# EAGLE design AVR-PROG (EAGLE 5.07)
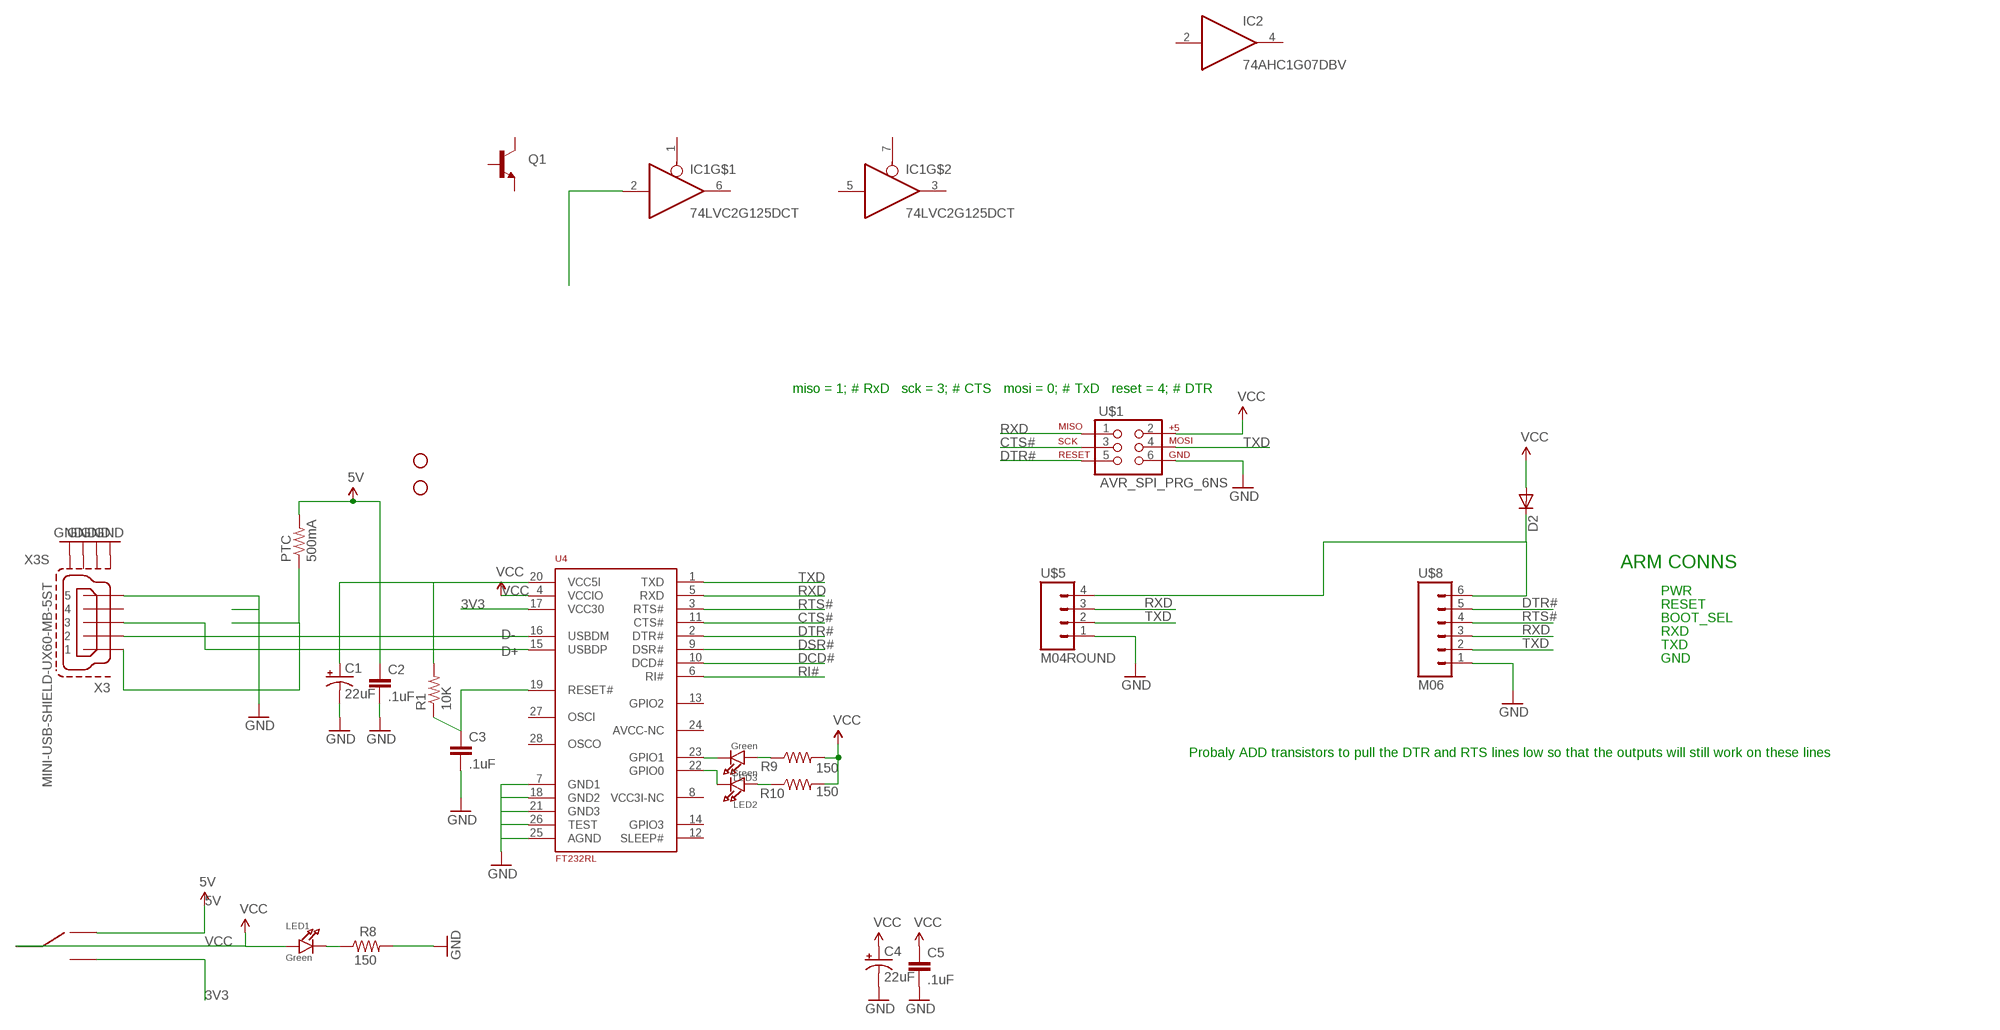
[diagram p0: schematic, sheet 1]

## Parts
C1  22uF  CAP_POL1206  [EIA3216]
C2  .1uF  CAP0805  [0805]
C3  .1uF  CAP0805  [0805]
C4  22uF  CAP_POL1206  [EIA3216]
C5  .1uF  CAP0805  [0805]
D2  DIODESOD  [SOD-323]
IC1  74LVC2G125DCT  [SSOP08]
IC2  74AHC1G07DBV  [SOT23-5]
LED1  Green  LED0805  [CHIPLED_0805]
LED2  Green  LED0805  [CHIPLED_0805]
LED3  Green  LED0805  [CHIPLED_0805]
PTC  500mA  RESISTOR  [0805]
Q1  TRANSISTOR_NPNSOT23-3  [SOT23-3]
R1  10K  RESISTOR  [0805]
R8  150  RESISTOR  [0805]
R9  150  RESISTOR  [0805]
R10  150  RESISTOR  [0805]
U4  FT232RL  [SSOP28]
U$1  AVR_SPI_PRG_6NS  [2X3-NS]
U$2  STAND-OFF  [STAND-OFF]
U$3  STAND-OFF  [STAND-OFF]
U$5  M04ROUND  [A19431-ROUND]
U$7  SWITCHSPDT  [OS102011MS2QS1]
U$8  M06  [A19433-ROUND]
X3  MINI-USB-SHIELD-UX60-MB-5ST  [UX60-MB-5ST]

## Nets
3V3: U4.17(VCC30) U$7.A
5V: C1.A(+) C2.1 PTC.2 R1.2 U4.20(VCC5I) U$7.B
CTS#: U4.11(CTS#) U$1.3
D+: U4.15(USBDP) X3.3
D-: U4.16(USBDM) X3.2
DCD#: U4.10(DCD#)
DSR#: U4.9(DSR#)
DTR#: U4.2(DTR#) U$1.5 U$8.5
GND [gnd]: C1.C(-) C2.2 C3.2 C4.C(-) C5.2 R8.2 U4.7(GND1) U4.18(GND2) U4.21(GND3) U4.25(AGND) U4.26(TEST) U$1.6 U$5.1 U$8.1 X3.5 X3.M1(S1) X3.M2(S2) X3.M3(S3) X3.M4(S4)
N$1: LED1.C R8.1
N$2: D2.1(C) U$5.4 U$8.6
N$3: IC1.2(I)
N$4: LED3.C U4.23(GPIO1)
N$5: PTC.1 X3.1
N$6: LED2.C U4.22(GPIO0)
N$35: LED3.A R9.1
N$36: LED2.A R10.1
RI#: U4.6(RI#)
RST: C3.1 R1.1 U4.19(RESET#)
RTS#: U4.3(RTS#) U$8.4
RXD: U4.5(RXD) U$1.1 U$5.3 U$8.3
TXD: U4.1(TXD) U$1.4 U$5.2 U$8.2
VCC: C4.A(+) C5.1 D2.2(A) LED1.A R9.2 R10.2 U4.4(VCCIO) U$1.2 U$7.COMMON
Unconnected: IC1.1(OE) IC1.3(O) IC1.5(I) IC1.6(O) IC1.7(OE) IC2.2(I) IC2.4(O) Q1.1(B) Q1.2(E) Q1.3(C) U4.8(VCC3I-NC) U4.12(SLEEP#) U4.13(GPIO2) U4.14(GPIO3) U4.24(AVCC-NC) U4.27(OSCI) U4.28(OSCO) X3.4

## Notes on the sheet
- miso = 1; # RxD   sck = 3; # CTS   mosi = 0; # TxD   reset = 4; # DTR
- ARM CONNS
- PWR
- RESET
- BOOT_SEL
- RXD
- TXD
- GND
- Probaly ADD transistors to pull the DTR and RTS lines low so that the outputs will still work on these lines

## Power pins joined to a net without a drawn wire
GND: IC1.4(GND) IC2.3(GND)
VCC: IC1.8(VCC) IC2.5(VCC)

## Library data of the parts
C1 C4 = SparkFun:CAP_POL: Capacitor Polarized These are standard SMD and PTH capacitors. Normally 10uF, 47uF, and 100uF in electrolytic and tantalum varieties. Always verify the external diameter of the through hole cap, it varies with capacity, voltage, and manufacturer. The EIA devices should be standard.
C2 C3 C5 = SparkFun:CAP: Capacitor Standard 0603 ceramic capacitor, and 0.1" leaded capacitor.
D2 = SparkFun:DIODE: Diode These are standard reverse protection diodes and small signal diodes. SMA package can handle up to about 1A. SOD-323 can handle about 200mA. What the SOD-323 package when ordering, there are some mfgs out there that are 5-pin packages.
IC1 = 74xx-little-us:74*2G125: Dual line drivers with 3-state outputs.
IC2 = 74xx-little-us:74*1G07: Single Buffer/Driver With Open-Drain Output
LED1-LED3 = microbuilder:LED: LED 0603 - 0603 Surface Mount Package Green LED - Low Power (3.9mcd, 2ma, 1.7Vf) Orange LED - Low Power (9.8mcd, 2ma, 1.8Vf) Red LED - Low Power (5mcd, 2ma, 1.8Vf) Yellow LED - Low Power (7mcd, 2ma, 1.8Vf) 0805 - 0805 Surface Mount Package Red LED (104mcd, 20mA, Diffused) - LS R976 [Digikey: 475-1278-6-ND] Red LED (12mcd, 20mA, 2.0Vf, Clear) - APT2012EC [Digikey: 754-1128-1-ND] Green LED (15mcd, 20mA, 2.2Vf, Clear) - APT2012GC [Digikey: 754-1131-1-ND] White LED (160mcd, 20mA, 2.1Vf, Clear) - APT2012SECK [Digikey: 754-1130-1-ND] 1206 - 1206 Surface Mount Package Green LED (26mcd, 20mA, Diffused) - LG N971 [Digikey: 475-1407-6-ND] Red LED (15mcd, 20mA, Diffused) - LH N974 [Digikey: 475-1416-6-ND]
PTC R1 R8-R10 = SparkFun:RESISTOR: Resistor Basic schematic elements and footprints for 0603, 1206, and PTH 1/10th watt (small) resistors.
Q1 = SparkFun:TRANSISTOR_NPN: Transistor NPN BJT configuration in SOT23 package. MMBT2222 is the common NPN we use. Double check BCE configuration again layout.
U4 = SmartPrj:FT232RL
U$1 = SparkFun:AVR_SPI_PRG_6: AVR ISP 6 Pin This is the reduced ISP connector for AVR programming. Common on Arduino. This footprint will take up less PCB space and can be used with a 10-pin to 6-pin adapter such as SKU: BOB-08508
U$2 U$3 = SparkFun:STAND-OFF: Stand Off This is the mechanical footprint for a #4 phillips button head screw. Use the keepout ring to avoid running the screw head into surrounding components. SKU : PRT-00447
U$5 = _Part Repository:M04: 4-Pin Headers
U$7 = JoesCustom:SWITCHSPDT
U$8 = _Part Repository:M06
X3 = con-hirose:MINI-USB-SHIELD-: MINI USB Connector Source: http://www.hirose.co.jp/cataloge_hp/e24000019.pdf

## Net classes
2 gnd: width 0.305 mm, drill 0.711 mm, clearance 0.254 mm
3 usbvcc: width 0.508 mm, drill 0.711 mm, clearance 0.254 mm

## Board
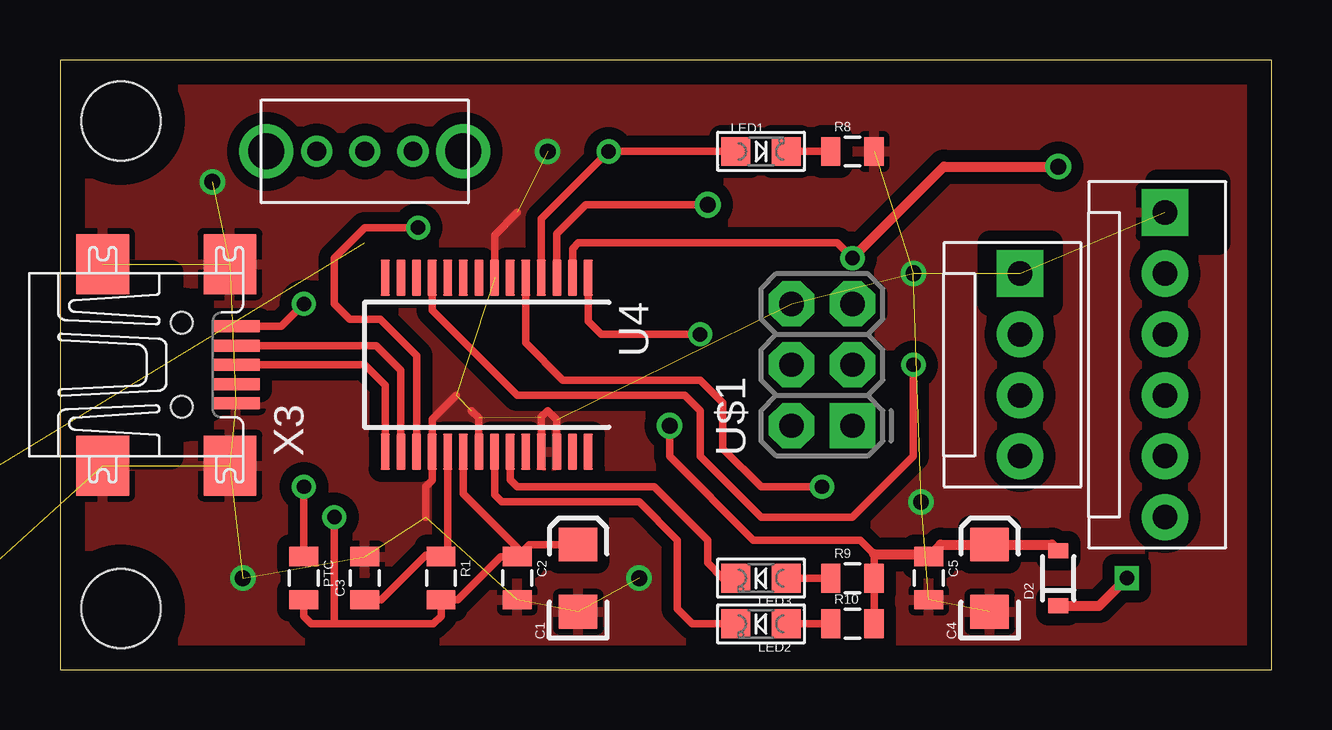
[diagram p1: board, top side]
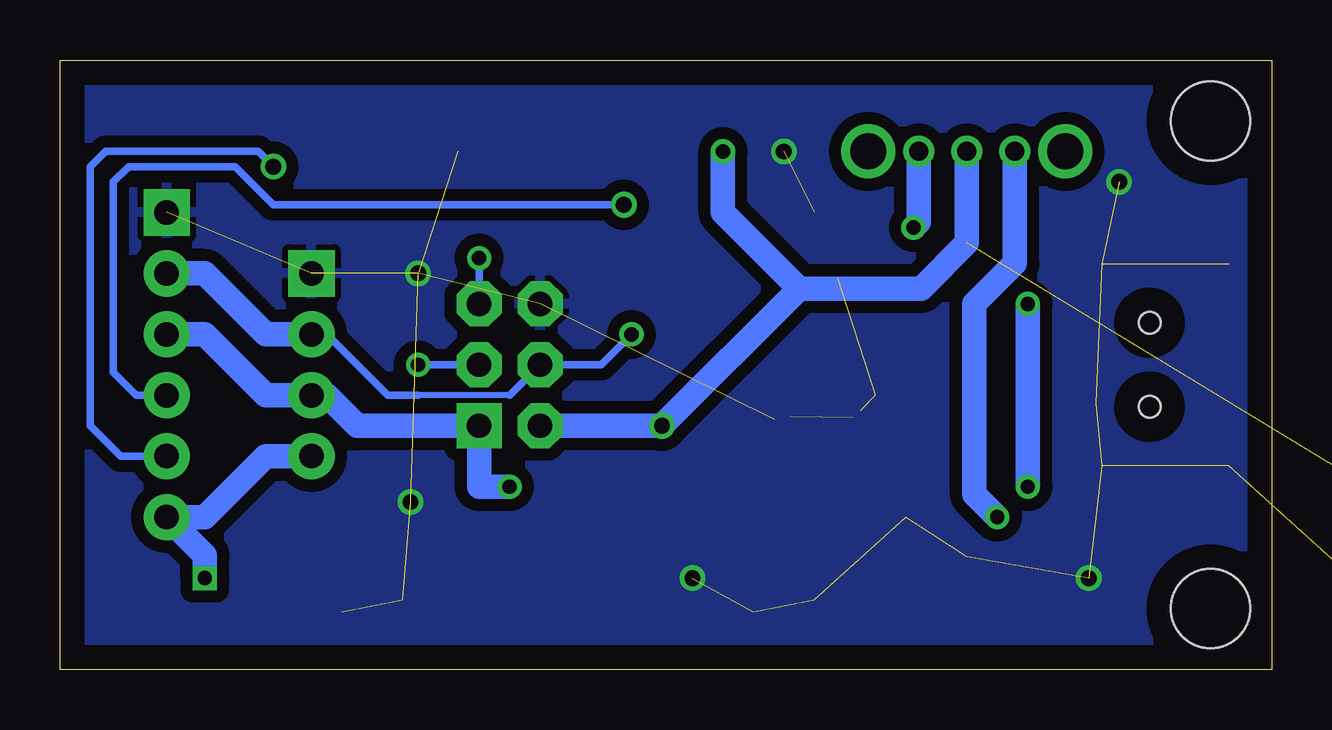
[diagram p2: board, bottom side, seen from below]

Size 50.48 x 25.4 mm. Coordinates in mm from the lower left corner, seen from the top.
Outline: 0,0 50.48,0 50.48,25.4 0,25.4 0,0
Copper layers (1*16): Top 0.035mm / dielectric 1.5mm / Bottom 0.035mm
Design rules "default": minimum track width 10mil, minimum drill 24mil, track to track 8mil, track to pad 8mil, pad to pad 8mil, via to via 8mil, smd to smd 8mil, copper to edge 40mil, drill to drill 8mil, minimum pad ring 10mil, minimum via ring 8mil, stop-mask expansion 4mil, vias tented up to drill 0mil, thermal gap 10mil
tRestrict: area 29.2,14 to 31.8,16.5; area 38.7,15.2 to 41.3,17.8; area 45.7,17.8 to 48.3,20.3

### Footprints (pad centres in the part's own frame; a part is rotated, then mirrored left to right if it is on the bottom)
EIA3216 = smd 1.4 x 1.6: A 1.4,0; C -1.4,0
0805 = smd 0.8 x 1.2: 1 -0.9,0; 2 0.9,0
SOD-323 = smd 0.63 x 0.83: 1 -1.15,0; 2 1.15,0
SSOP08 = smd 0.4 x 1: 1 -0.975,-1.8; 2 -0.325,-1.8; 3 0.325,-1.8; 4 0.975,-1.8; 5 0.975,1.8; 6 0.325,1.8; 7 -0.325,1.8; 8 -0.975,1.8
SOT23-5 = smd 0.69 x 0.99: 1 -0.95,-1.29; 2 0,-1.29; 3 0.95,-1.29; 4 0.95,1.3; 5 -0.95,1.3
CHIPLED_0805 = smd 1.2 x 1.2: A 0,-1.05; C 0,1.05
SOT23-3 = smd 0.8 x 0.9: 1 -0.95,-1; 2 0.95,-1; 3 0,1.1
SSOP28 = smd 0.381 x 1.499: 1 -4.225,-3.625; 2 -3.575,-3.625; 3 -2.925,-3.625; 4 -2.275,-3.625; 5 -1.625,-3.625; 6 -0.975,-3.625; 7 -0.325,-3.625; 8 0.325,-3.625; 9 0.975,-3.625; 10 1.625,-3.625; 11 2.275,-3.625; 12 2.925,-3.625; 13 3.575,-3.625; 14 4.225,-3.625; 15 4.225,3.625; 16 3.575,3.625; 17 2.925,3.625; 18 2.275,3.625; 19 1.625,3.625; 20 0.975,3.625; 21 0.325,3.625; 22 -0.325,3.625; 23 -0.975,3.625; 24 -1.625,3.625; 25 -2.275,3.625; 26 -2.925,3.625; 27 -3.575,3.625; 28 -4.225,3.625
2X3-NS = drill 1.016 pad 1.88 square: 1 -2.54,-1.27 | drill 1.016 pad 1.88 octagon: 2 -2.54,1.27; 3 0,-1.27; 4 0,1.27; 5 2.54,-1.27; 6 2.54,1.27
STAND-OFF = hole 3.302: 0,0
A19431-ROUND = drill 1.02 pad 1.93 square: 1 3.81,0 | drill 1.02 pad 1.93 round: 2 1.27,0; 3 -1.27,0; 4 -3.81,0
OS102011MS2QS1 = drill 0.787 round: A -2.007,0; B 2.007,0; COMMON 0,0 | drill 1.499 pad 1.905 round: CASE -4.102,0; CASE@1 4.102,0
A19433-ROUND = drill 1.02 pad 1.93 square: 1 6.35,0 | drill 1.02 pad 1.93 round: 2 3.81,0; 3 1.27,0; 4 -1.27,0; 5 -3.81,0; 6 -6.35,0
UX60-MB-5ST = smd 2 x 0.5: 1 2.25,1.6; 2 2.25,0.8; 3 2.25,0; 4 2.25,-0.8; 5 2.25,-1.6 | smd 2.2 x 2.5: M1 -3.3,-4.2; M2 -3.3,4.2; M3 2,4.2; M4 2,-4.2 | hole 0.9: 0,-1.75; 0,1.75

### Placement (x,y rotation side)
C1  21.59,3.81 90 top
C2  19.05,3.81 270 top
C3  12.7,3.81 90 top
C4  38.73,3.81 90 top
C5  36.2,3.81 270 top
D2  41.59,3.81 90 top
IC1  -6.35,3.81 0 top  (outside the outline)
IC2  -16.51,3.81 0 top  (outside the outline)
LED1  29.21,21.59 270 top
LED2  29.21,1.91 90 top
LED3  29.21,3.81 90 top
PTC  10.16,3.81 270 top
Q1  -21.59,-6.35 0 top  (outside the outline)
R1  15.88,3.81 270 top
R8  33.02,21.59 0 top
R9  33.02,3.81 0 top
R10  33.02,1.91 0 top
U4  17.78,12.7 180 top
U$1  31.75,12.7 90 top
U$2  2.54,22.86 0 top
U$3  2.54,2.54 0 top
U$5  40.01,12.7 90 top
U$7  12.7,21.59 180 top
U$8  46.04,12.7 90 top
X3  5.08,12.7 0 top

### Tracks (layer width: path | path; a pad name or v marks a point on that pad's centre or on a via)
3V3  (via drill 0.6)
  Top 0.305: U4.17 14.86,13.09 13.34,14.61 12.06,14.61 11.43,15.24 11.43,17.14 12.7,18.41 v14.92,18.41
  Bottom 1.016: U$7.A 14.71,18.63 v14.92,18.41
5V  (via drill 0.6)
  Top 0.305: U4.20 16.8,7.33 19.05,5.08 C2.1 | C1.A 19.55,5.21 C2.1 | C2.1 18.36,4.71 16.56,2.91 R1.2 15.88,2.22 15.56,1.91 11.43,1.91 | PTC.2 10.16,2.22 10.48,1.91 11.43,1.91 | 11.43,1.91 v11.43,6.35
  Bottom 1.016: U$7.B 10.69,16.93 12.38,15.24 12.38,7.3 v11.43,6.35
CTS#  (via drill 0.6)
  Top 0.305: U4.11 15.51,14.97 19.05,11.43 26.04,11.43 26.67,10.79 26.67,8.89 29.21,6.35 33.02,6.35 35.56,8.89 v35.56,12.7
  Bottom 0.305: v35.56,12.7 U$1.3
D+
  Top 0.305: U4.15 13.55,11.85 12.7,12.7 X3.3
D-
  Top 0.305: U4.16 14.21,12.46 13.17,13.5 X3.2
DTR#  (via drill 0.6, 0.66)
  Top 0.305: U4.2 21.36,17.55 21.59,17.78 32.38,17.78 v33.02,17.14
  Top 0.406: v41.59,20.95 36.83,20.95 v33.02,17.14
  Bottom 0.305: v33.02,17.14 U$1.5 | U$8.5 47.94,8.89 49.21,10.16 49.21,20.95 48.58,21.59 42.23,21.59 v41.59,20.95
GND  (via drill 0.66)  (25 unrouted)
  Top 0.305: U4.21 17.45,10.48 17.14,10.79 | U4.26 20.7,10.41 20.32,10.79 20.05,10.53 U4.25 | 16.51,11.43 15.51,10.43 U4.18 15.51,7.88 15.24,7.62 15.24,6.35 | U4.7 18.11,18.11 19.05,19.05
  other vias: 7.62,3.81 6.35,20.32 20.32,21.59 35.56,16.51 24.13,3.81 35.88,6.99
  pour Top (isolate 0.508): 0,0 50.48,0 50.48,25.4 0,25.4
  pour Bottom (isolate 0.508): 0,0 50.16,0 50.16,25.4 0,25.4
N$1
  Top 0.305: LED1.C R8.1
N$2  (via drill 0.6)
  Top 0.406: D2.1 43.3,2.66 v44.45,3.81
  Bottom 1.016: v44.45,3.81 44.45,4.76 U$8.6 44.45,6.35 41.91,8.89 U$5.4
N$4
  Top 0.305: U4.23 18.75,7.92 19.05,7.62 24.77,7.62 26.99,5.4 26.99,4.45 27.62,3.81 LED3.C
N$5  (via drill 0.6)
  Top 0.305: v10.16,15.24 9.22,14.3 X3.1 | PTC.1 v10.16,7.62
  Bottom 1.016: v10.16,7.62 v10.16,15.24
N$6
  Top 0.305: U4.22 18.11,7.29 18.41,6.99 24.13,6.99 25.72,5.4 25.72,2.54 26.35,1.91 LED2.C
N$35
  Top 0.305: LED3.A R9.1
N$36
  Top 0.305: LED2.A R10.1
RST
  Top 0.305: U4.19 16.16,4.99 R1.1 15.82,4.76 15.24,4.76 13.39,2.91 C3.1
RTS#  (via drill 0.66)
  Top 0.305: v26.99,19.37 21.91,19.37 20.7,18.16 U4.3
  Bottom 0.305: U$8.4 47.31,11.43 48.26,12.38 48.26,20.32 47.62,20.95 43.18,20.95 41.59,19.37 v26.99,19.37
RXD  (via drill 0.6)
  Top 0.305: U4.5 19.41,13.62 20.95,12.06 26.67,12.06 27.62,11.11 27.62,9.21 29.21,7.62 v31.75,7.62
  Bottom 1.016: v31.75,7.62 33.02,7.62 U$1.1 38.1,10.16 39.37,11.43 U$5.3 41.91,11.43 44.45,13.97 U$8.3
TXD  (via drill 0.6)
  Top 0.305: U4.1 22,14.51 22.54,13.97 v26.67,13.97
  Bottom 0.254: 31.75,11.43 35.56,11.43
  Bottom 0.305: v26.67,13.97 27.94,12.7 U$1.4 31.75,11.43 | 35.56,11.43 36.83,11.43 39.37,13.97 U$5.2
  Bottom 1.016: U$5.2 41.91,13.97 44.45,16.51 U$8.2
VCC  (via drill 0.6, 0.66)  (2 unrouted)
  Top 0.305: U4.4 20.05,18.79 v22.86,21.59 LED1.A | R10.2 R9.2 33.92,4.82 33.34,5.4 28.89,5.4 25.4,8.89 v25.4,10.16
  Top 0.406: 33.92,4.82 36.09,4.82 C5.1 36.7,5.21 C4.A 41.34,5.21 D2.2
  Bottom 1.016: U$7.COMMON 12.7,17.78 14.61,15.88 19.68,15.88 | 19.68,15.88 v25.4,10.16 U$1.2 | 19.68,15.88 22.86,19.05 v22.86,21.59